# Altium schematic sheet motor_DRV.SchDoc
size A4; SheetNumber: 2; SheetTotal: 2
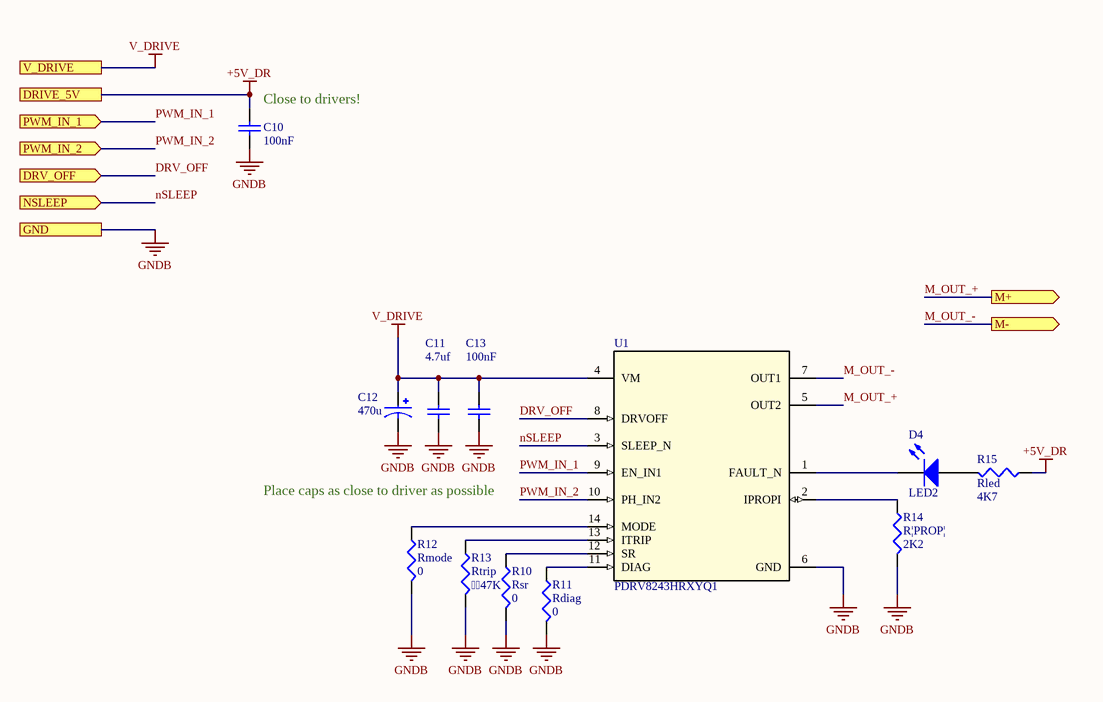
[diagram p0: motor_DRV.SchDoc]

## Parts
C10  value 100nF  [1608[0603]]  (hidden comment: Cap Semi)
C11  value 4.7uf  [1608[0603]]  (hidden comment: Cap Semi)
C12  470u  [CAPPRD500W60D800H1500]
C13  value 100nF  [1608[0603]]  (hidden comment: Cap Semi)
D4  LED2  [1608[0603]]
R10  Rsr  value 0  [J1-0603]
R11  Rdiag  value 0  [J1-0603]
R12  Rmode  value 0  [J1-0603]
R13  Rtrip  value 47K  [J1-0603]
R14  R|PROP|  value 2K2  [J1-0603]
R15  Rled  value 4K7  [J1-0603]
U1  PDRV8243HRXYQ1  [RXY0014A-MFG]

## Ports
DRIVE_5V, DRV_OFF (in), GND, M+ (out), M- (out), NSLEEP (in), PWM_IN_1 (in), PWM_IN_2 (in), V_DRIVE

## Nets
+5V_DR: C10.2 R15.2 ; port DRIVE_5V
GNDB: C10.1 C11.1 C12.N C13.1 R10.2 R11.2 R12.2 R13.2 R14.2 U1.6(GND) ; port GND
V_DRIVE: C11.2 C12.P C13.2 U1.4(VM) ; port V_DRIVE
DRV_OFF: U1.8(DRVOFF) ; port DRV_OFF
M_OUT_+: U1.5(OUT2) ; port M+
M_OUT_-: U1.7(OUT1) ; port M-
nSLEEP: U1.3(SLEEP_N) ; port NSLEEP
PWM_IN_1: U1.9(EN_IN1) ; port PWM_IN_1
PWM_IN_2: U1.10(PH_IN2) ; port PWM_IN_2
NetD4_1: D4.1(A) R15.1
NetD4_2: D4.2(K) U1.1(FAULT_N)
NetR10_1: R10.1 U1.12(SR)
NetR11_1: R11.1 U1.11(DIAG)
NetR12_1: R12.1 U1.14(MODE)
NetR13_1: R13.1 U1.13(ITRIP)
NetR14_1: R14.1 U1.2(IPROPI)

## Notes on the sheet
- (near C10) Close to drivers!
- Place caps as close to driver as possible

## Library data of the parts
C10 C11 C13 = Cap Semi: Capacitor (Semiconductor SIM Model); Published: 8-Jun-2000; LatestRevisionDate: 29-May-2009; LatestRevisionNote: IPC-7351 Footprint Added.; PackageReference: C1206; Publisher: Altium Limited; PackageDescription: Chip Capacitor
C12 = EEUFR1E471YB: 470F 25V Aluminum Electrolytic Capacitors Radial, Can 8000 Hrs @ 105C; MF: Panasonic; Value: *; Price: None; Availability: In Stock; SnapEDA_Link: https://www.snapeda.com/parts/EEUFR1E471YB/Panasonic/view-part/5797024/?ref=snap; Check_prices: https://www.snapeda.com/parts/EEUFR1E471YB/Panasonic/view-part/5797024/?ref=eda; Package: RADIAL-2 Panasonic; MP: EEUFR1E471YB
D4 = LED2: Typical RED, GREEN, YELLOW, AMBER GaAs LED; Published: 8-Jun-2000; LatestRevisionDate: 17-Jul-2002; LatestRevisionNote: Re-released for DXP Platform.; PackageVersion: Feb-2002; PackageReference: 3.2X1.6X1.1; Publisher: Altium Limited; PackageDescription: SM LED; 2 Flat Leads
R10-R15 = Res3: Resistor; Published: 8-Jun-2000; LatestRevisionDate: 29-May-2009; LatestRevisionNote: IPC-7351 Footprint Added.; PackageReference: J1-0603; Publisher: Altium Limited; PackageDescription: Chip Resistor
U1 = PDRV8243HRXYQ1: No Description Available; Mfr_Name: Texas Instruments; Type: DEV; RefDes: RefDes; Copyright: Copyright (C) 2021 Ultra Librarian. All rights reserved.; Manufacturer_Part_Number: PDRV8243HRXYQ1